# Altium project Beetech Metro Shield 1.1.PrjPcb
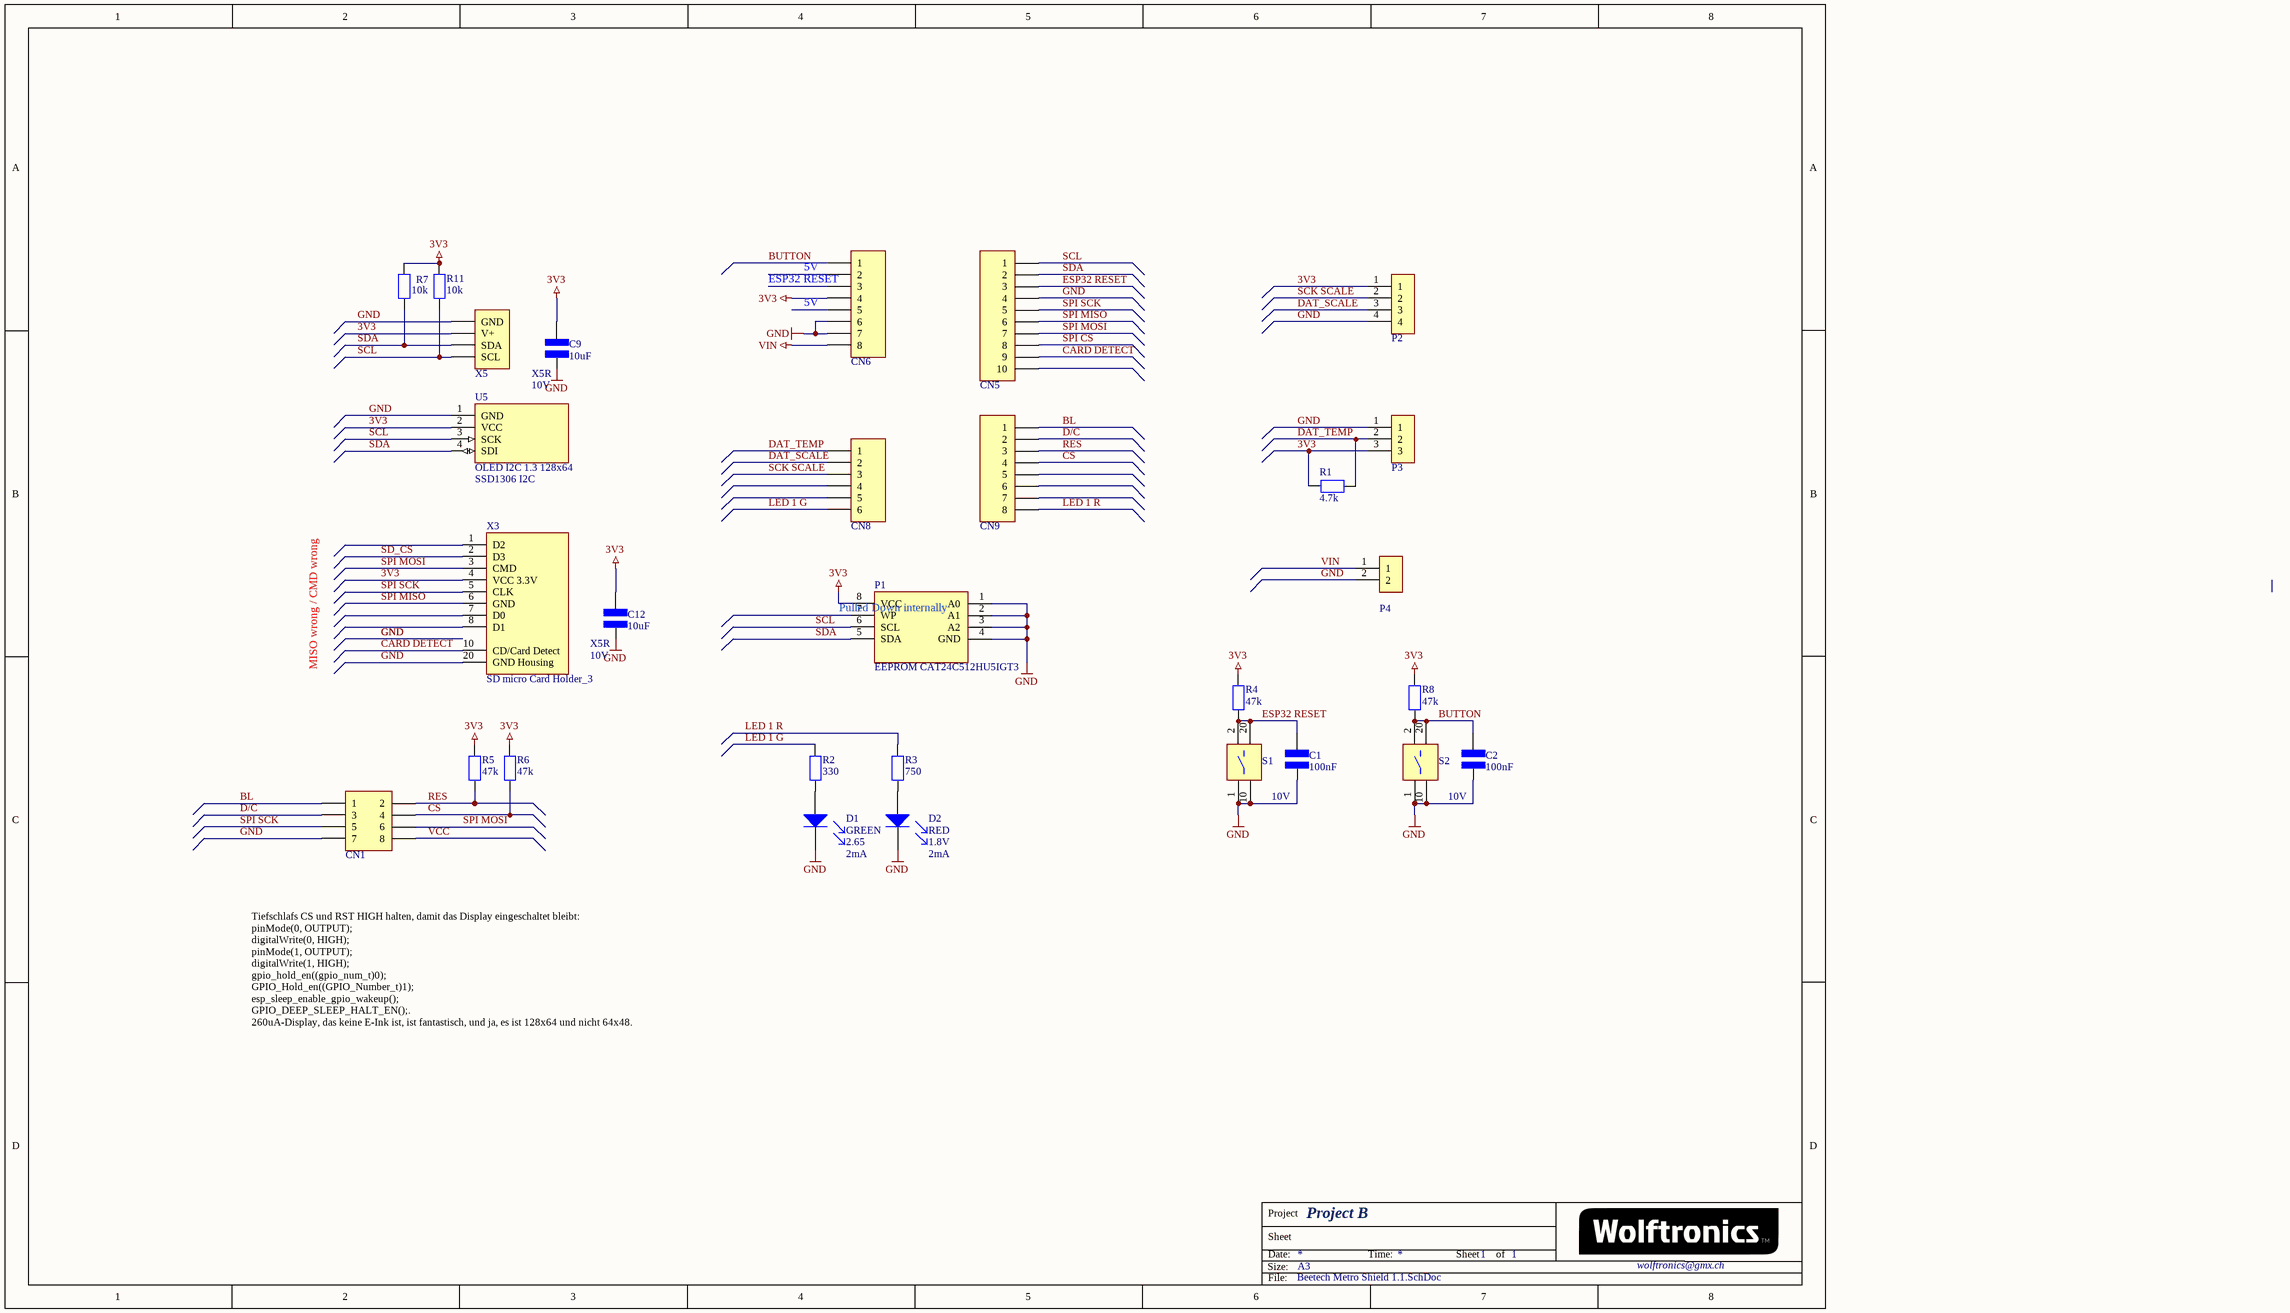
[diagram p0: Beetech Metro Shield 1.1.SchDoc]
1 sheet, 29 parts. Net scope: global (net labels, ports and power ports of the same name join across sheets).
Board file: Beetech Metro Shield 1.1.PcbDoc

## Sheet Beetech Metro Shield 1.1.SchDoc: Project B
size A3; ApprovedBy: A. Wolf; CheckedBy: A. Wolf; Author: A. Wolf; CompanyName: EHT; DrawnBy: A. Wolf; Engineer: A. Wolf; Organization: IGP - Space Geodesy; DocumentNumber: 1; Revision: 1; SheetNumber: 1; SheetTotal: 1; Time: 23.8.2024

### Parts
C1  value 100nF  Umax: 10V  [CAP 0603 - OUTLINE]  (hidden comment: 100nF 0603)
C2  value 100nF  Umax: 10V  [CAP 0603 - OUTLINE]  (hidden comment: 100nF 0603)
C9  value 10uF  Umax: 10V  Dielektrikum: X5R  [CAP 0603 - OUTLINE]  (hidden comment: 10uF 0603)
C12  value 10uF  Umax: 10V  Dielektrikum: X5R  [CAP 0603 - OUTLINE]  (hidden comment: 10uF 0603)
CN1  4 X 2  Header  [4 x 2 2.54mm - no Connector]  (value not drawn)
CN5  10-Pin Stiftleiste 10x1 2.54 Low Profile  [10PIN - III]  (value not drawn)
CN6  8-Pin Stiftleiste 8x1 2.54 Low Profile  [8 PIN - Stiftleiste]  (value not drawn)
CN8  6-PiN  [6PIN]  (value not drawn)
CN9  8-Pin Stiftleiste 8x1 2.54 Low Profile  [8 PIN - Stiftleiste]  (value not drawn)
D1  COLOR: GREEN  Forward Voltage: 2.65  If: 2mA  [LED SMD 0603 FOOTPRINT]  (hidden comment: LED Diode SMD LOW CURRENT)
D2  COLOR: RED  Forward Voltage: 1.8V  If: 2mA  [LED SMD 0603 FOOTPRINT]  (hidden comment: LED Diode SMD LOW CURRENT)
P1  EEPROM CAT24C512HU5IGT3  [UDFN8 3.0x2.0 CAT24C512HU5IGT3]
P2  4-Pin Right Angle Housing  [4PIN - RND 205-EK254-2.54-04P]  (value not drawn)
P3  3-Pin Right Angle Housing  [3PIN - RND 205-EK254-2.54-03P]  (value not drawn)
P4  2-Pin Right Angle Housing  [2PIN - RND 205-EK254-2.54-02P]  (value not drawn)
R1  value 4.7k  [RES 0603 FOOTPRINT - OUTLINE]  (hidden comment: 4.7k Ohm 0603)
R2  value 330  [RES 0603 FOOTPRINT - OUTLINE]  (hidden comment: 330 Ohm 0603)
R3  value 750  [RES 0603 FOOTPRINT - OUTLINE]  (hidden comment: 750 Ohm 0603)
R4  value 47k  [RES 0603 FOOTPRINT - OUTLINE]  (hidden comment: 47k Ohm 0603)
R5  value 47k  [RES 0603 FOOTPRINT - OUTLINE]  (hidden comment: 47k Ohm 0603)
R6  value 47k  [RES 0603 FOOTPRINT - OUTLINE]  (hidden comment: 47k Ohm 0603)
R7  value 10k  [RES 0603 FOOTPRINT - OUTLINE]  (hidden comment: 10k Ohm 0603)
R8  value 47k  [RES 0603 FOOTPRINT - OUTLINE]  (hidden comment: 47k Ohm 0603)
R11  value 10k  [RES 0603 FOOTPRINT - OUTLINE]  (hidden comment: 10k Ohm 0603)
S1  Taster Print_SMD_2  [Taster Print - SMD - KMR241G LFS]  (value not drawn)
S2  Taster Print_SMD_2  [Taster Print - SMD - KMR241G LFS]  (value not drawn)
U5  OLED I2C 1.3 128x64  [OLED 1.3 128x64 I2C]
X3  SD micro Card Holder_3  [SD Card Holder - micro - 3 - sd Card inserted]
X5  4-Pin  [QWIIC JST CONNECTOR - SMD 4-PIN]  (value not drawn)

### Nets
3V3: C9.2 C12.2 CN6.4 P1.8(VCC) P2.1 P3.3 R1.2 R4.1 R5.2 R6.2 R7.2 R8.1 R11.2 U5.2(VCC) X3.4(VCC_3.3V) X5.3(V+)
GND: C1.1 C2.1 C9.1 C12.1 CN1.7 CN5.4 CN6.6 CN6.7 D1.2(K) D2.2(K) P1.1(A0) P1.2(A1) P1.3(A2) P1.4(GND) P2.4 P3.1 P4.2 S1.1 S1.10 S2.1 S2.10 U5.1(GND) X3.20(GND_Housing) X5.4(GND)
VIN: CN6.8 P4.1
BL: CN1.1 CN9.1
BUTTON: C2.2 CN6.1 R8.2 S2.2 S2.20
CARD DETECT: CN5.9 X3.10(CD/Card_Detect)
CS: CN1.4 CN9.4 R6.1
D/C: CN1.3 CN9.2
DAT_SCALE: CN8.2 P2.3
DAT_TEMP: CN8.1 P3.2 R1.1
ESP32 RESET: C1.2 CN5.3 R4.2 S1.2 S1.20
LED 1 G: CN8.6 R2.2
LED 1 R: CN9.8 R3.2
RES: CN1.2 CN9.3 R5.1
SCK SCALE: CN8.3 P2.2
SCL: CN5.1 P1.6(SCL) R11.1 U5.3(SCK) X5.1(SCL)
SD_CS: X3.2(D3)
SDA: CN5.2 P1.5(SDA) R7.1 U5.4(SDI) X5.2(SDA)
SPI CS: CN5.8
SPI MISO: CN5.6 X3.6(GND)
SPI MOSI: CN1.6 CN5.7 X3.3(CMD)
SPI SCK: CN1.5 CN5.5 X3.5(CLK)
VCC: CN1.8
NetD1_1: D1.1(A) R2.1
NetD2_1: D2.1(A) R3.1

Not connected (* = marked no-connect by the designer): CN5 10; CN6 2 3 5; CN8 4 5; CN9 5 6 7; P1 7(WP); X3 1(D2) 7(D0) 8(D1)

### Notes on the sheet
- (near CN6) 5V
- (near CN6) ESP32 RESET
- (near P1) Pulled Down internally
- MISO wrong / CMD wrong
- Tiefschlafs CS und RST HIGH halten, damit das Display eingeschaltet bleibt:
  pinMode(0, OUTPUT);
  digitalWrite(0, HIGH);
  pinMode(1, OUTPUT);
  digitalWrite(1, HIGH);
  gpio_hold_en((gpio_num_t)0);
  GPIO_Hold_en((GPIO_Number_t)1);
  esp_sleep_enable_gpio_wakeup();
  GPIO_DEEP_SLEEP_HALT_EN();.
  260uA-Display, das keine E-Ink ist, ist fantastisch, und ja, es ist 128x64 und nicht 64x48.
- Project
- Size:
- Sheet
- Date:
- A3
- Time:
- of
- wolftronics@gmx.ch
- File:

### Library data of the parts
C1 C2 = 100nF 0603: C CERAMIC SMD; Bezeichnung: C SMD; Hersteller: Würth; Hersteller Nr: 885012206020; Haendler: Mouser; Haendler Nr: 710-885012206020; Preis (CHF): 0.05; housing/footprint: 0603
C9 C12 = 10uF 0603: C CERAMIC SMD; Bezeichnung: C SMD; Hersteller: TDK; Hersteller Nr: C1608X5R1A106K080AC; Haendler: Mouser; Haendler Nr: 810-C1608X5R1A106K; Preis (CHF): 0.5; housing/footprint: 0603
CN1 = 4 X 2  Header: Haendler: Mouser; Haendler Nr: 200-SSQ10403TD; Preis (CHF): 1.5; Hersteller: Samtec; Hersteller Nr: SSQ-104-03-T-D
CN5 = 10-Pin Stiftleiste 10x1 2.54 Low Profile: Low Profile 10-Pin Stiftleiste 10x1 2.54 Low Profile; Haendler: Mouser; Haendler Nr: 200-TLW11006GS; Preis (CHF): 2.2; Hersteller: Samtec; Hersteller Nr: TLW-110-06-G-S
CN6 CN9 = 8-Pin Stiftleiste 8x1 2.54 Low Profile: Low Profile 8-Pin Stiftleiste 8x1 2.54; Haendler: Mouser; Haendler Nr: 200-TLW10806TS; Haendler2: Farnell; Haendler2 Nr: 2856894; Preis (CHF): 1.06; Link: https://www.mouser.ch/Connectors/Headers-Wire-Housings/_/N-ay0lo?P=1ytkls2&Keyword=tlw-108&FS=True
D1 = LED Diode SMD - GREEN - 0603 - 2mA_1: LED Green APT1608LZGCK; Haendler: Mouser; Haendler Nr: 604-APT1608LZGCK; Hersteller: Knightbright; Preis (CHF): 0.321; Link: http://ch.farnell.com/kingbright/kpt-1608lvzgck/led-gr-n-50mcd-525nm-smd/dp/2610409; Hersteller NR: APT1608LZGCK
D2 = LED Diode SMD - RED - 0603 - 2mA_1: LED Red APT1608LSECKJ3RV; Haendler: Mouser; Haendler Nr: 604-APT1608LSECKJ3RV; Hersteller: Knightbright; Preis (CHF): 0.6; Hersteller NR: APT1608LSECKJ3RV
P1 = EEPROM CAT24C512HU5IGT3: Hersteller: ON SEMICONDUCTOR; Haendler Nr: 863-CAT24C512HU5IGT3; Preis (CHF): 0.8; Haendler: Mouser; Hersteller Nr: CAT24C512HU5IGT3; Datasheet: https://www.mouser.ch/ProductDetail/onsemi/CAT24C512HU5IGT3?qs=5C9Q4QJFsuOiuCBGwG%2FnpA%3D%3D
P2 = 4-Pin Screw Terminal: 4-Pin; Preis (CHF): 0.60; Haendler: Distrelec; Hersteller: RND; Hersteller Nr: RND 205-EK254-2.54-04P; Haendler Nr: 301-27-920; ComponentLink1Description: Mouser; ComponentLink1URL: https://www.mouser.ch/ProductDetail/TE-Connectivity/640453-2?qs=sGAEpiMZZMs%252bGHln7q6pm5E1Eb6qwPl2KIU5TYv3tVY%3d
P3 = 3-Pin Screw Terminal: 3-Pin; Preis (CHF): 0.60; Haendler: Distrelec; Haendler Nr: 301-27-919; ComponentLink1Description: Mouser; ComponentLink1URL: https://www.mouser.ch/ProductDetail/TE-Connectivity/640453-2?qs=sGAEpiMZZMs%252bGHln7q6pm5E1Eb6qwPl2KIU5TYv3tVY%3d
P4 = 2-Pin Screw Terminal: 2-Pin; Preis (CHF): 0.60; Haendler: Distrelec; Hersteller: RND 205-EK254-2.54-02P; Haendler Nr: 301-27-918; ComponentLink1Description: Mouser; ComponentLink1URL: https://www.mouser.ch/ProductDetail/TE-Connectivity/640453-2?qs=sGAEpiMZZMs%252bGHln7q6pm5E1Eb6qwPl2KIU5TYv3tVY%3d
R1 = 4.7k Ohm 0603: R SMD; Haendler: Mouser; Haendler Nr: 755-ESR03EZPF4701; Preis (CHF): 0.01; Bezeichnung: R SMD; housing/footprint: 0603
R2 = 330 Ohm 0603: R SMD; Hersteller: YAGEO; Hersteller Nr: RC0603FR-07330RL; Haendler: Mouser; Haendler Nr: 603-RC0603FR-07330RL; Preis (CHF): 0.01; Bezeichnung: R SMD; housing/footprint: 0603
R3 = 750 Ohm 0603: R SMD; Hersteller: Panasonic; Haendler: Mouser; Haendler Nr: 71-CRCW0603750RFKEAH; Preis (CHF): 0.0123; Haendler2: Farnell; Haendler2 Nr: 2059597; Bezeichnung: R SMD; housing/footprint: 0603
R4-R6 R8 = 47k Ohm 0603: R SMD; Hersteller: Yageo; Hersteller Nr: AC0603FR-0747KL; Haendler: Mouser; Haendler Nr: 603-AC0603FR-0747KL; Preis (CHF): 0.01; Bezeichnung: R SMD; housing/footprint: 0603
R7 R11 = 10k Ohm 0603: R SMD; Hersteller: Yageo; Hersteller Nr: AC0603FR-0710KL; Haendler: Mouser; Haendler Nr: 603-AC0603FR-0710KL; Preis (CHF): 0.01; Bezeichnung: R SMD; housing/footprint: 0603
S1 S2 = Taster Print_SMD_2: Taster; Haendler Nr: 611-KMR241GLFS; Haendler: Mouser; Hersteller: C&K; Hersteller Nr: KMR241G LFS; Preis (CHF): 0.5; Haendler2 Nr: 1437637; Haendler2: Farnell; Link: http://ch.farnell.com/c-k-components/kmr241g-lfs/taster-smd-4n/dp/1437637; Link Hersteller: http://www.ckswitches.com/products/switches/product-details/Tactile/KMR2/KMR241NGLFS/
U5 = OLED I2C 1.3 128x64: SSD1306 I2C; Preis (CHF): 2; Haendler Nr: OLED I2C 128x64; Haendler: Aliexpress; Link: https://de.aliexpress.com/item/1005008365029314.html?gatewayAdapt=glo2deu#nav-specification; Chip: SSD1306 I2C
X3 = SD micro Card Holder_3: SD micro Card  Holder; Hersteller Nr: MEM2075-00-140-01-A; Hersteller: GCT; Haendler Nr: 640-MEM20750014001A; Haendler: Mouser; Preis (CHF): 1.6; Haendler2 Nr: 2073-MEM2075-00-140-01-ATR-ND; Haendler2: Digikey
X5 = 4-Pin QWIIC JST CONNECTOR - SMD 4_1: QWIIC JST CONNECTOR - SMD 4-PIN; Haendler: Mouser; Haendler Nr: 306-SM04BSRSSTBLFSN; Haendler2: Digikey; Haendler2 Nr: 455-SM04B-SRSS-TBCT-ND; Preis (CHF): 0.5; Hersteller: Molex; Hersteller Nr: SM04B-SRSS-TB; Link: https://cdn-learn.adafruit.com/downloads/pdf/introducing-adafruit-stemma-qt.pdf?timestamp=1629187570; Haendler2 Nr 2: 455-SM04B-SRSS-TBCT-ND
CN8 = 6-PiN: LatestRevisionDate: 17-Jul-2002; LatestRevisionNote: Re-released for DXP Platform.; Publisher: Altium Limited